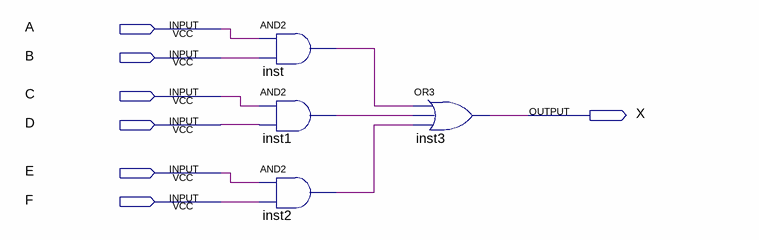
[diagram p0: schematic sheet]
// Quartus schematic eleven.bdf as structural Verilog: 4 symbols, 7 pins
module eleven (
  input  A,
  input  B,
  input  C,
  input  D,
  input  E,
  input  F,
  output X
);

  wire inst1_out, inst2_out, inst_out;

  and inst (inst_out, A, B);
  and inst1 (inst1_out, C, D);
  and inst2 (inst2_out, E, F);
  or inst3 (X, inst_out, inst1_out, inst2_out);
endmodule
